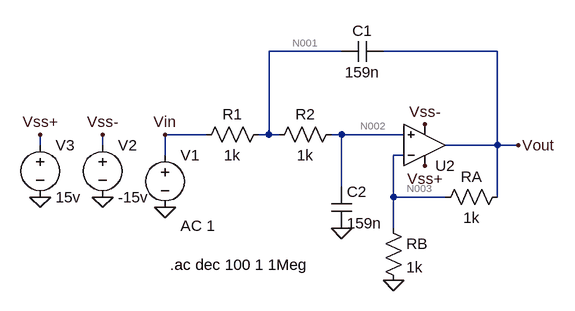
[diagram p0: schematic Sallen-key_2nd_order.asc]
Sallen-key_2nd_order.asc, the LTspice schematic file:
Version 4
SHEET 1 880 680
WIRE 208 -32 96 -32
WIRE 448 -32 272 -32
WIRE 0 96 -64 96
WIRE 96 96 96 -32
WIRE 96 96 80 96
WIRE 112 96 96 96
WIRE 208 96 192 96
WIRE 304 96 208 96
WIRE -256 112 -256 96
WIRE -160 112 -160 96
WIRE 448 112 448 -32
WIRE 448 112 368 112
WIRE 480 112 448 112
WIRE -64 128 -64 96
WIRE 304 128 288 128
WIRE 208 176 208 96
WIRE 288 192 288 128
WIRE 368 192 288 192
WIRE 448 192 448 112
WIRE 288 240 288 192
FLAG 208 240 0
FLAG 288 320 0
FLAG -64 208 0
FLAG 480 112 Vout
FLAG -64 96 Vin
FLAG -160 192 0
FLAG -256 192 0
FLAG -256 96 Vss+
FLAG -160 96 Vss-
FLAG 336 80 Vss-
FLAG 336 144 Vss+
SYMBOL res 96 80 R90
WINDOW 0 0 56 VBottom 2
WINDOW 3 32 56 VTop 2
SYMATTR InstName R1
SYMATTR Value 1k
SYMBOL res 208 80 R90
WINDOW 0 0 56 VBottom 2
WINDOW 3 32 56 VTop 2
SYMATTR InstName R2
SYMATTR Value 1k
SYMBOL cap 272 -48 R90
WINDOW 0 0 32 VBottom 2
WINDOW 3 32 32 VTop 2
SYMATTR InstName C1
SYMATTR Value 159n
SYMBOL cap 192 176 R0
SYMATTR InstName C2
SYMATTR Value 159n
SYMBOL res 272 224 R0
SYMATTR InstName RB
SYMATTR Value 1k
SYMBOL res 464 176 R90
WINDOW 0 0 56 VBottom 2
WINDOW 3 32 56 VTop 2
SYMATTR InstName RA
SYMATTR Value 1k
SYMBOL OpAmps\\UniversalOpAmp 336 112 M180
SYMATTR InstName U2
SYMBOL voltage -64 112 R0
WINDOW 123 24 124 Left 2
WINDOW 39 0 0 Left 0
SYMATTR Value2 AC 1
SYMATTR InstName V1
SYMATTR Value ""
SYMBOL voltage -160 96 R0
WINDOW 123 0 0 Left 0
WINDOW 39 0 0 Left 0
SYMATTR InstName V2
SYMATTR Value -15v
SYMBOL voltage -256 96 R0
WINDOW 123 0 0 Left 0
WINDOW 39 0 0 Left 0
SYMATTR InstName V3
SYMATTR Value 15v
TEXT -56 296 Left 2 !.ac dec 100 1 1Meg

The netlist it stands for:
* Sallen-key_2nd_order.asc
R1 N001 Vin 1k
R2 N002 N001 1k
C1 Vout N001 159n
C2 N002 0 159n
RB N003 0 1k
RA Vout N003 1k
XU2 N002 N003 Vss+ Vss- Vout level1 Avol=1Meg GBW=10Meg Vos=0 En=0 Enk=0 In=0 Ink=0 Rin=500Meg  ; pins In+ In- V+ V- OUT
V1 Vin 0 AC 1
V2 Vss- 0 -15v
V3 Vss+ 0 15v
.ac dec 100 1 1Meg
.lib UniversalOpAmp1.lib
.backanno
.end

* Results of the author's LTspice run, read from the files saved beside the schematic
* Operating Point, zero values left out:
*   V(vss+) = 15 V
*   V(vss-) = -15 V
*   I(V3) = -30 nA
*   I(V2) = 30 nA
*   Ix(u2:3) = 30 nA
*   Ix(u2:4) = -30 nA
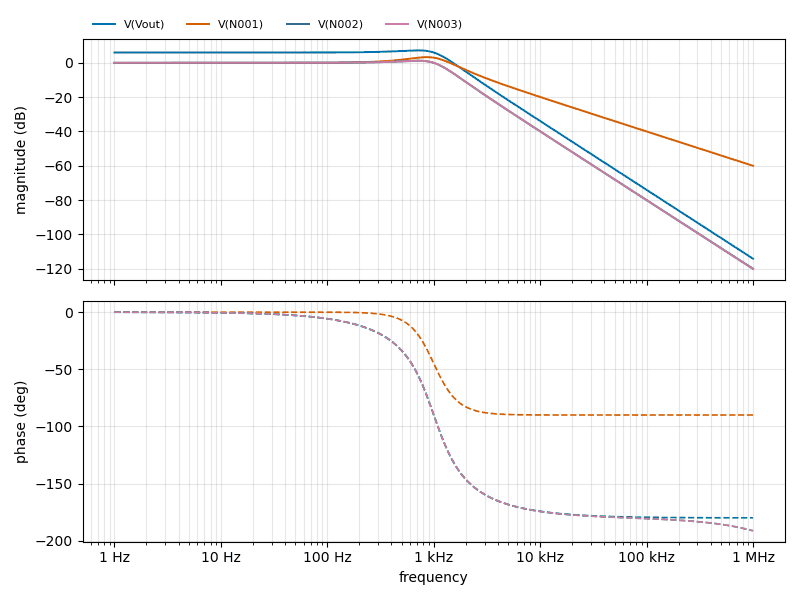
[diagram p1: AC Analysis of Sallen-key_2nd_order.asc, plotted from the saved traces]
* AC Analysis, 1 run:
*   V(Vout): 6.02 dB at 1 Hz, -114.14 dB at 1 MHz, peak 7.27 dB at 707.9 Hz, 3 dB below the peak at 1.17 kHz
*   V(N001): -0.00 dB at 1 Hz, -59.99 dB at 1 MHz, peak 3.33 dB at 851.1 Hz, 3 dB below the peak at 195.2 Hz and 1.376 kHz
*   V(N002): -0.00 dB at 1 Hz, -119.99 dB at 1 MHz, peak 1.25 dB at 707.9 Hz, 3 dB below the peak at 1.17 kHz
*   V(N003): -0.00 dB at 1 Hz, -120.16 dB at 1 MHz, peak 1.25 dB at 707.9 Hz, 3 dB below the peak at 1.17 kHz